# Altium project BMS_Carrier_Board.PrjPcb (part 1 of 2)
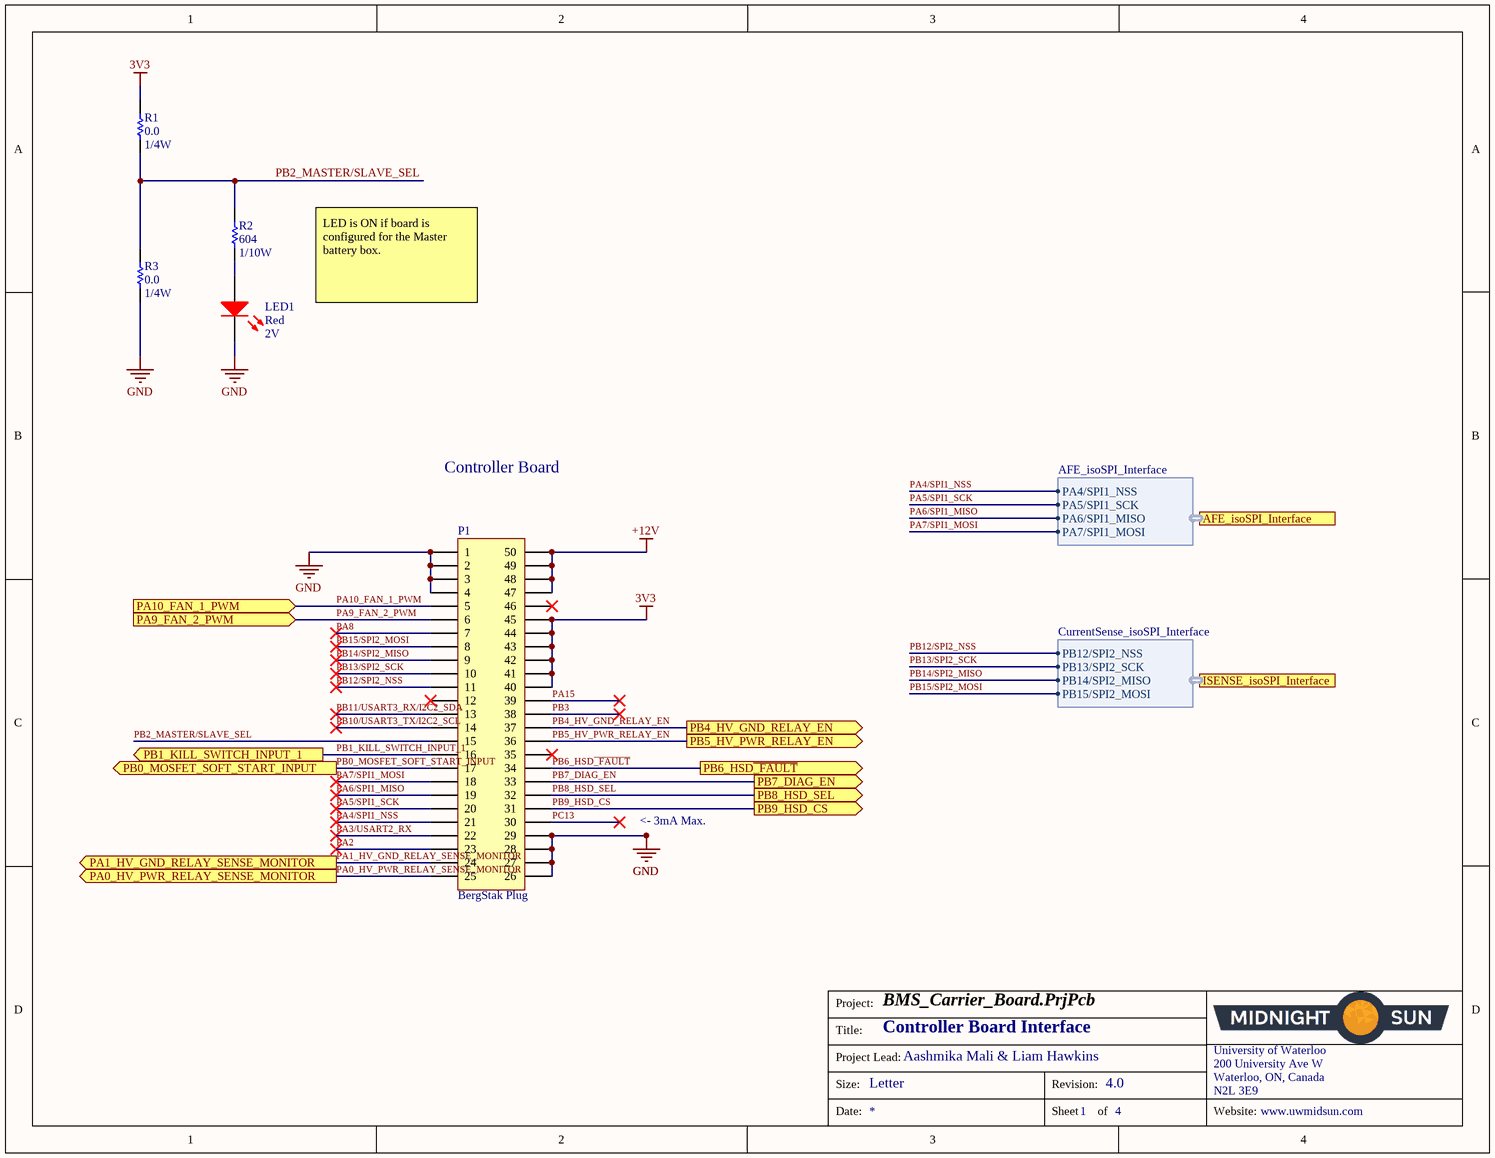
[diagram p0: Controller_Board_Interface.SchDoc]
MSPartNumber: MS-ELE0003; ProjectAuthor: Aashmika Mali & Liam Hawkins; ProjectRevision: 4.0
7 sheets, 99 parts. Net scope: flat (ports and power ports of the same name join across sheets).
Board file: BMS_Carrier_Board.PcbDoc
Sheets:
  Controller_Board_Interface.SchDoc
  BMS Carrier - Connectors.SchDoc
  BMS Carrier - AFE Interface.SchDoc
  BMS Carrier - Current Sense Interface.SchDoc
  BMS Carrier - Battery Relay Controls.SchDoc
  BMS Carrier - Firmware Contactor Control.SchDoc
  BMS Carrier - Fan Controls.SchDoc

## Sheet Controller_Board_Interface.SchDoc: Controller Board Interface
size Letter; Author: Kevin Chen, Taiping Li; DrawnBy: Kevin Chen; DocumentNumber: 1; SheetNumber: 1; SheetTotal: 4; Website: www.uwmidsun.com

### Parts
LED1  Color: Red  Voltage - Forward (Vf) (Typ): 2V  [LED_0603]  (hidden comment: LED RED CLEAR 2V 0603)
P1  Series: BergStak Plug  [CONN, Bergstak 50 Pos Plug]  (hidden comment: CONN 50POS Bergstak Plug 0.02")
R1  Resistance: 0.0  Power (Watts): 1/4W  [RES, 0603]  (hidden comment: RES 0.0 OHM 1/4W 0603)
R2  Resistance: 604  Power: 1/10W  [RES, 0603]  (hidden comment: RES 604 OHM 1% 1/10W 0603)
R3  Resistance: 0.0  Power (Watts): 1/4W  [RES, 0603]  (hidden comment: RES 0.0 OHM 1/4W 0603)

### Ports
AFE_isoSPI_Interface (harness AFE_isoSPI_Interface), ISENSE_isoSPI_Interface (harness CurrentSense_isoSPI_Interface), PA0_HV_PWR_RELAY_SENSE_MONITOR (out), PA1_HV_GND_RELAY_SENSE_MONITOR (out), PA9_FAN_2_PWM (in), PA10_FAN_1_PWM (in), PB0_MOSFET_SOFT_START_INPUT (out), PB1_KILL_SWITCH_INPUT_1 (out), PB4_HV_GND_RELAY_EN (out), PB5_HV_PWR_RELAY_EN (out), PB6_HSD~{_FAULT} (out), PB7_DIAG_EN (out), PB8_HSD_SEL (out), PB9_HSD_CS (out)

### Harnesses
AFE_isoSPI_Interface: PA7/SPI1_MOSI, PA6/SPI1_MISO, PA5/SPI1_SCK, PA4/SPI1_NSS
CurrentSense_isoSPI_Interface: PB15/SPI2_MOSI, PB14/SPI2_MISO, PB13/SPI2_SCK, PB12/SPI2_NSS

### Nets
3V3: P1.40 P1.41 P1.42 P1.43 P1.44 P1.45 R1.1
+12V: P1.47 P1.48 P1.49 P1.50
GND: LED1.2(K) P1.1 P1.2 P1.3 P1.4 P1.26 P1.27 P1.28 P1.29 R3.2
PA0_HV_PWR_RELAY_SENSE_MONITOR: P1.25 ; port PA0_HV_PWR_RELAY_SENSE_MONITOR
PA1_HV_GND_RELAY_SENSE_MONITOR: P1.24 ; port PA1_HV_GND_RELAY_SENSE_MONITOR
PA2: P1.23
PA3/USART2_RX: P1.22
PA4/SPI1_NSS: P1.21 ; port AFE_isoSPI_Interface.PA4/SPI1_NSS
PA5/SPI1_SCK: P1.20 ; port AFE_isoSPI_Interface.PA5/SPI1_SCK
PA6/SPI1_MISO: P1.19 ; port AFE_isoSPI_Interface.PA6/SPI1_MISO
PA7/SPI1_MOSI: P1.18 ; port AFE_isoSPI_Interface.PA7/SPI1_MOSI
PA8: P1.7
PA9_FAN_2_PWM: P1.6 ; port PA9_FAN_2_PWM
PA10_FAN_1_PWM: P1.5 ; port PA10_FAN_1_PWM
PA15: P1.39
PB0_MOSFET_SOFT_START_INPUT: P1.17 ; port PB0_MOSFET_SOFT_START_INPUT
PB1_KILL_SWITCH_INPUT_1: P1.16 ; port PB1_KILL_SWITCH_INPUT_1
PB2_MASTER/SLAVE_SEL: P1.15 R1.2 R2.1 R3.1
PB3: P1.38
PB4_HV_GND_RELAY_EN: P1.37 ; port PB4_HV_GND_RELAY_EN
PB5_HV_PWR_RELAY_EN: P1.36 ; port PB5_HV_PWR_RELAY_EN
PB6_HSD~{_FAULT}: P1.34 ; port PB6_HSD~{_FAULT}
PB7_DIAG_EN: P1.33 ; port PB7_DIAG_EN
PB8_HSD_SEL: P1.32 ; port PB8_HSD_SEL
PB9_HSD_CS: P1.31 ; port PB9_HSD_CS
PB10/USART3_TX/I2C2_SCL: P1.14
PB11/USART3_RX/I2C2_SDA: P1.13
PB12/SPI2_NSS: P1.11 ; port ISENSE_isoSPI_Interface.PB12/SPI2_NSS
PB13/SPI2_SCK: P1.10 ; port ISENSE_isoSPI_Interface.PB13/SPI2_SCK
PB14/SPI2_MISO: P1.9 ; port ISENSE_isoSPI_Interface.PB14/SPI2_MISO
PB15/SPI2_MOSI: P1.8 ; port ISENSE_isoSPI_Interface.PB15/SPI2_MOSI
PC13: P1.30
NetLED1_1: LED1.1(A) R2.2

Not connected (* = marked no-connect by the designer): P1 12* 35* 46*

### Notes on the sheet
- LED is ON if board is configured for the Master battery box.
- Controller Board
- <- 3mA Max.
- Project:
- Title:
- Size:
- Project Lead:
- Letter
- Revision:
- University of Waterloo
- 200 University Ave W
- Waterloo, ON, Canada
- N2L 3E9
- Date:
- Sheet
- of
- Website:

### Library data of the parts
LED1 = LED RED CLEAR 2V 0603: Red 631nm LED Indication - Discrete 2V 0603 (1608 Metric); Manufacturer: Wurth Electronics Inc.; Manufacturer Part Number: 150060RS75000; Lens Color: Colorless; Millicandela Rating: 250mcd; Lens Style/Size: Rectangle with Flat Top, 1.10mm x 0.70mm; Current - Test: 20mA; Viewing Angle: 140°; Wavelength - Dominant: 625nm; Wavelength - Peak: 630nm; Supplier 1: Digi-Key; RoHS: RoHS Compliant; Category: Optoelectronics; Stock 1: 35521; Pricing 1: 1=0.21, 100=0.1617, 500=0.13964 (CAD); Packaging: Cut Tape (CT); Part Status: Active; Lens Transparency: Clear; Mounting Type: Surface Mount; Features: -; Package / Case: 0603 (1608 Metric); Supplier Device Package: 0603; Size / Dimension: 1.60mm L x 0.80mm W; Height (Max): 0.80mm; ComponentLink1URL: http://katalog.we-online.de/led/datasheet/150060RS75000.pdf; ComponentLink1Description: http://katalog.we-online.de/led/datasheet/150060RS75000.pdf; Supplier Part Number 1: 732-4978-1-ND
P1 = CONN 50POS Bergstak Plug 0.02": 50 Position Connector Plug, Outer Shroud Contacts Surface Mount Gold; Manufacturer 1: Amphenol FCI; Manufacturer Part Number 1: 10132797-055100LF; Number of Positions: 50; Mated Stacking Heights: 5mm; Pitch: 0.020" (0.50mm); Supplier 1: Digi-Key; Supplier Part Number 1: 609-5226-1-ND; Packaging: Cut Tape (CT); Part Status: Active; Connector Type: Plug, Outer Shroud Contacts; Number of Rows: 2; Mounting Type: Surface Mount; Contact Finish: Gold; Contact Finish Thickness: 1µin (0.025µm); Height Above Board: 0.169" (4.30mm); ComponentLink1URL: http://portal.fciconnect.com/Comergent//fci/drawing/10132797.pdf; ComponentLink1Description: http://portal.fciconnect.com/Comergent//fci/drawing/10132797.pdf
R1 R3 = RES 0.0 OHM 1/4W 0603: RES SMD 0.0 OHM JUMPER 1/4W 0603; Manufacturer 1: Vishay Dale; Manufacturer Part Number 1: CRCW06030000Z0EAHP; Supplier 1: Digi-Key; Supplier Part Number 1: 541-0.0SBCT-ND; Packaging: Cut Tape (CT); Part Status: Active; Composition: Thick Film; Operating Temperature: -55°C ~ 155°C; Package / Case: 0603 (1608 Metric); Supplier Device Package: 0603; Size / Dimension: 0.063" L x 0.033" W (1.60mm x 0.85mm); Height - Seated (Max): 0.022" (0.55mm); Failure Rate: -; ComponentLink1URL: http://www.vishay.com/docs/20043/crcwhpe3.pdf; ComponentLink1Description: http://www.vishay.com/docs/20043/crcwhpe3.pdf
R2 = RES 604 OHM 1% 1/10W 0603: RES SMD 604 OHM 1% 1/10W 0603; Manufacturer 1: Yageo; Manufacturer Part Number 1: RC0603FR-07604RL; Temperature Coefficient: ±100ppm/°C; Supplier 1: Digi-Key; Supplier Part Number 1: 311-604HRCT-ND; Packaging: Cut Tape (CT); Part Status: Active; Composition: Thick Film; Operating Temperature: -55°C ~ 155°C; Package / Case: 0603 (1608 Metric); Supplier Device Package: 0603; Size / Dimension: 0.063" L x 0.031" W (1.60mm x 0.80mm); Height - Seated (Max): 0.022" (0.55mm); Failure Rate: -; ComponentLink1URL: http://www.yageo.com/documents/recent/PYu-RC_Group_51_RoHS_L_7.pdf; ComponentLink1Description: http://www.yageo.com/documents/recent/PYu-RC_Group_51_RoHS_L_7.pdf; Tolerance: ±1%

## Sheet BMS Carrier - Connectors.SchDoc: BMS Fan and Relay Control
size B; Author: Kevin Chen, Taiping Li; DocumentNumber: 4; SheetNumber: 4; SheetTotal: 4; Website: www.uwmidsun.com
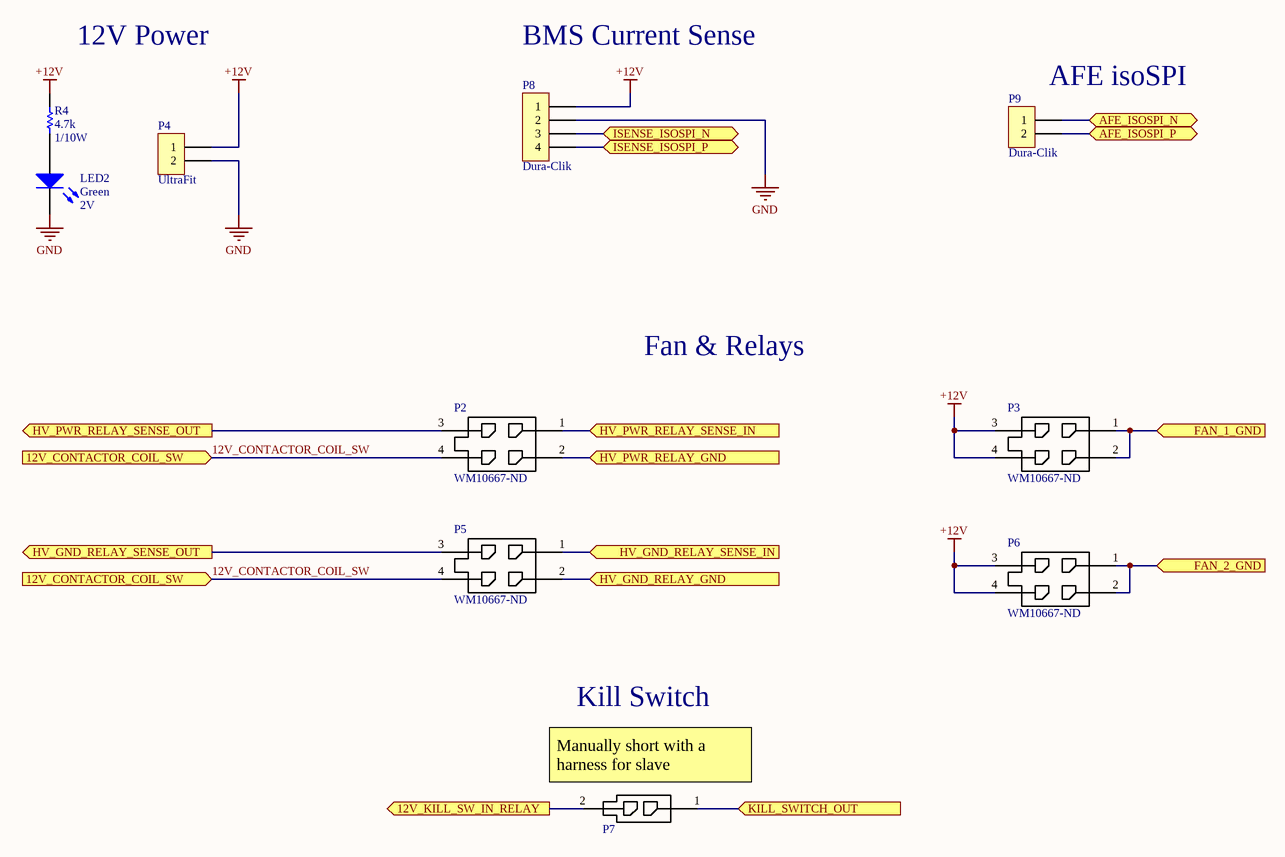
[diagram p1: BMS Carrier - Connectors.SchDoc]

### Parts
LED2  Color: Green  Voltage - Forward (Vf) (Typ): 2V  [LED_0603]  (hidden comment: LED GREEN CLEAR 2V 0603)
P2  Supplier Part Number 1: WM10667-ND  [CONN 4POS MICROFIT (2x2)]  (hidden comment: CONN 4POS MICRO-FIT 3mm)
P3  Supplier Part Number 1: WM10667-ND  [CONN 4POS MICROFIT (2x2)]  (hidden comment: CONN 4POS MICRO-FIT 3mm)
P4  Series: UltraFit  [CONN, 2POS ULTRA-FIT]  (hidden comment: CONN 2POS ULTRA-FIT 0.138")
P5  Supplier Part Number 1: WM10667-ND  [CONN 4POS MICROFIT (2x2)]  (hidden comment: CONN 4POS MICRO-FIT 3mm)
P6  Supplier Part Number 1: WM10667-ND  [CONN 4POS MICROFIT (2x2)]  (hidden comment: CONN 4POS MICRO-FIT 3mm)
P7  CONN 2POS MICRO-FIT 3mm  [CONN, 2POS MICRO-FIT]  (value not drawn)
P8  Dura-Clik  [CONN, 4POS DURA-CLIK VERT]
P9  Dura-Clik  [CONN, 2POS Dura-Click Vertical]
R4  Resistance (Ohms): 4.7k  Power (Watts): 1/10W  [RES, 0603]  (hidden comment: RES 4.7K OHM 1% 1/10W 0603)

### Ports
12V_CONTACTOR_COIL_SW (in), 12V_KILL_SW_IN_RELAY (out), AFE_ISOSPI_N (bidir), AFE_ISOSPI_P (bidir), FAN_1_GND (in), FAN_2_GND (in), HV_GND_RELAY_GND (in), HV_GND_RELAY_SENSE_IN (in), HV_GND_RELAY_SENSE_OUT (out), HV_PWR_RELAY_GND (in), HV_PWR_RELAY_SENSE_IN (in), HV_PWR_RELAY_SENSE_OUT (out), ISENSE_ISOSPI_N (bidir), ISENSE_ISOSPI_P (bidir), KILL_SWITCH_OUT (in)

### Nets
3V3: P2.3 P5.3 ; port HV_PWR_RELAY_SENSE_OUT, port HV_GND_RELAY_SENSE_OUT
+12V: P3.3 P3.4 P4.1 P6.3 P6.4 P8.1 R4.1
GND: LED2.2(K) P4.2 P8.2
12V_CONTACTOR_COIL_SW: P2.4 P5.4 ; port 12V_CONTACTOR_COIL_SW
12V_KILL_SW_to_Relay: P7.2 ; port 12V_KILL_SW_IN_RELAY
CURR_ISOSPI_N: P8.3 ; port ISENSE_ISOSPI_N
CURR_ISOSPI_P: P8.4 ; port ISENSE_ISOSPI_P
ISOSPI_N: P9.1 ; port AFE_ISOSPI_N
ISOSPI_P: P9.2 ; port AFE_ISOSPI_P
NetC14_1: P2.1 ; port HV_PWR_RELAY_SENSE_IN
NetC18_1: P5.1 ; port HV_GND_RELAY_SENSE_IN
NetD1_1: P2.2 ; port HV_PWR_RELAY_GND
NetD3_1: P5.2 ; port HV_GND_RELAY_GND
NetLED2_1: LED2.1(A) R4.2
NetLED5_2: P3.1 P3.2 ; port FAN_1_GND
NetLED6_2: P6.1 P6.2 ; port FAN_2_GND
NetP7_1: P7.1 ; port KILL_SWITCH_OUT

### Notes on the sheet
- 12V Power
- BMS Current Sense
- (near P9) AFE isoSPI
- Fan & Relays
- Kill Switch
- (near P7) Manually short with a harness for slave
- PROJECT
- DOCUMENT
- DRAWN BY
- LAST MODIFIED
- PART NUMBER
- REVISION
- SHEET
- VARIANT
- OF
- Engineering 5 - 1002
  University of Waterloo
  (519) 888-4567 x32978
  hardware@uwmidsun.com

### Library data of the parts
LED2 = LED GREEN CLEAR 2V 0603: Green 572nm LED Indication - Discrete 2V 0603 (1608 Metric); Manufacturer: Wurth Electronics Inc.; Manufacturer Part Number: 150060VS75000; Lens Color: Colorless; Millicandela Rating: 40mcd; Lens Style/Size: Rectangle with Flat Top, 1.10mm x 0.70mm; Current - Test: 20mA; Viewing Angle: 140°; Wavelength - Dominant: 570nm; Supplier 1: Digi-Key; RoHS: RoHS Compliant; Category: Optoelectronics; Stock 1: 9408; Pricing 1: 1=0.21, 100=0.1617, 500=0.13964 (CAD); Packaging: Cut Tape (CT); Part Status: Active; Lens Transparency: Clear; Mounting Type: Surface Mount; Wavelength - Peak: 572nm; Features: -; Package / Case: 0603 (1608 Metric); Supplier Device Package: 0603; Size / Dimension: 1.60mm L x 0.80mm W; Height (Max): 0.80mm; ComponentLink1URL: http://katalog.we-online.de/led/datasheet/150060VS75000.pdf; ComponentLink1Description: http://katalog.we-online.de/led/datasheet/150060VS75000.pdf; Supplier Part Number 1: 732-4980-1-ND
P2 P3 P5 P6 = CONN 4POS MICRO-FIT 3mm: Micro-Fit 3.0 Vertical Header, 3.00mm Pitch, Dual Row, 4 Circuits, with PCB Polarizing Peg, Tin, Glow-Wire Capable, Black; Manufacturer: Molex, LLC; Manufacturer Part Number: 0430450827; Pitch - Mating: 0.118" (3.00mm); Number of Positions: 6; Number of Positions Loaded: All; Style: Board to Cable/Wire; Shrouding: Shrouded - 4 Wall; Contact Length - Post: 0.125" (3.18mm); Material Flammability Rating: UL94 V-0; Contact Resistance: 10mR; Number of Contacts: 4; Number of Ports: 1; Row Spacing: 0.118inch; RoHS: RoHS Compliant; Category: Connectors, Interconnects; Packaging: Tray; Part Status: Active; Connector Type: Header; Contact Type: Male Pin; Number of Rows: 2; Row Spacing - Mating: 0.118" (3.00mm); Mounting Type: Through Hole; Termination: Solder; Fastening Type: Locking Ramp; Contact Length - Mating: -; Overall Contact Length: -; Insulation Height: 0.390" (9.91mm); Contact Shape: Square; Contact Finish - Mating: Tin; Contact Finish Thickness - Mating: 60.0µin (1.52µm); Contact Finish - Post: Tin; Contact Material: Brass; Insulation Material: Liquid Crystal Polymer (LCP), Glass Filled; Features: Board Guide; Operating Temperature: -; Ingress Protection: -; Insulation Color: Black; Current Rating: -; Voltage Rating: -; Mated Stacking Heights: -; Contact Finish Thickness - Post: -; Applications: General Purpose, Medical, Military, Telecommunications; ComponentLink1URL: https://www.molex.com/pdm_docs/sd/430450627_sd.pdf; ComponentLink1Description: https://www.molex.com/pdm_docs/sd/430450627_sd.pdf; ComponentLink2URL: https://www.molex.com/pdm_docs/sd/430450827_sd.pdf; ComponentLink2Description: https://www.molex.com/pdm_docs/sd/430450827_sd.pdf; Mount: Through Hole; Contact Plating: Tin; Housing Material: Polymer; Color: Black; Number of Terminals: 4; Housing Color: Black; Min Operating Temperature: -40°C; Max Operating Temperature: 105°C; Package Quantity: 2232; Orientation: Straight; Length: 10.15mm; Pitch: 3mm; Depth: 8.77mm; ComponentLink3URL: http://www.molex.com/pdm_docs/sd/430450427_sd.pdf; ComponentLink3Description: http://www.molex.com/pdm_docs/sd/430450427_sd.pdf; ComponentLink4URL: http://www.molex.com/webdocs/datasheets/pdf/en-us/0430450427_PCB_HEADERS.pdf; ComponentLink4Description: http://www.molex.com/webdocs/datasheets/pdf/en-us/0430450427_PCB_HEADERS.pdf; Supplier 1: Digi-Key
P4 = CONN 2POS ULTRA-FIT 0.138": 2 Positions Header, Shrouded Connector 0.138" (3.50mm) Through Hole Gold; Manufacturer 1: Molex, LLC; Manufacturer Part Number 1: 1722861302; Style: Board to Board or Cable; Shrouding: Shrouded - 4 Wall; Number of Positions: 2; Number of Positions Loaded: All; Contact Length - Post: 0.126" (3.20mm); Material Flammability Rating: UL94 V-0; Mated Stacking Heights: 26.99mm; Voltage: 400V; Supplier 1: Digi-Key; Supplier Part Number 1: WM11673-ND; Packaging: Tray; Part Status: Active; Connector Type: Header; Contact Type: Male Pin; Pitch - Mating: 0.138" (3.50mm); Number of Rows: 1; Row Spacing - Mating: -; Mounting Type: Through Hole; Termination: Kinked Pin, Solder; Fastening Type: Latch Holder; Contact Length - Mating: -; Overall Contact Length: -; Insulation Height: 0.465" (11.80mm); Contact Shape: Square; Contact Finish - Mating: Gold; Contact Finish Thickness - Mating: 30µin (0.76µm); Contact Finish - Post: Tin; Contact Material: Copper Alloy; Insulation Material: Liquid Crystal Polymer (LCP); Operating Temperature: -40°C ~ 120°C; Ingress Protection: -; Insulation Color: Black; Current Rating: -; Contact Finish Thickness - Post: 60µin (1.52µm); ComponentLink1URL: http://www.molex.com/pdm_docs/sd/1722861302_sd.pdf; ComponentLink1Description: http://www.molex.com/pdm_docs/sd/1722861302_sd.pdf
P7 = CONN 2POS MICRO-FIT 3mm: Connector Header Through Hole 2 position; Manufacturer: Molex; Manufacturer Part Number: 43045-0227; Number of Positions: 2; Current Rating: 5A; Gender: Male; Contact Resistance: 10mR; Number of Ports: 1; Max Voltage Rating (DC): 250.25kV; Voltage Rating: 600V; Glow Wire Compliant: Compliant; Supplier 1: Digi-Key; Supplier Part Number 1: WM10657-ND; Packaging: Tray; Number of Rows: 2; Termination: Solder; Contact Material: Brass; ComponentLink1URL: http://www.onlinecomponents.com/productFiles/mf-MOL/307170430450227_pcb_headers.pdf; ComponentLink1Description: http://www.onlinecomponents.com/productFiles/mf-MOL/307170430450227_pcb_headers.pdf; Stock 1: 3657; Pricing 1: 1=0.84, 10=0.74, 25=0.6968, 50=0.6676, 100=0.6387, 250=0.5806, 500=0.52254, 1000=0.46448, 2500=0.42094 (USD); Mount: Through Hole; Contact Plating: Tin; Housing Colour: Black; Housing Material: Thermoplastic; Number of Terminals: 2; Min Operating Temperature: -40°C; Max Operating Temperature: 105°C; Number of Contacts: 2; Orientation: Vertical; Package Quantity: 3168; Number of Circuits: 2; Length: 7.15mm; Pitch: 3mm; Depth: 8.77mm; Row Spacing: 3mm; Radiation Hardening: No; Halogen Free: Low Halogen; ComponentLink2URL: http://www.mouser.com/ds/2/276/0430450227_PCB_HEADERS-142611.pdf; ComponentLink2Description: http://www.mouser.com/ds/2/276/0430450227_PCB_HEADERS-142611.pdf; ComponentLink3URL: http://uk.rs-online.com/webdocs/13c3/0900766b813c3a46.pdf; ComponentLink3Description: http://uk.rs-online.com/webdocs/13c3/0900766b813c3a46.pdf; ComponentLink4URL: http://www.molex.com/webdocs/datasheets/pdf/en-us/0430450227_PCB_HEADERS.pdf; ComponentLink4Description: http://www.molex.com/webdocs/datasheets/pdf/en-us/0430450227_PCB_HEADERS.pdf
P8 = CONN 4POS DURA-CLIK 0.079": 4 Positions Header Connector 0.079" (2.00mm) Surface Mount Tin; Manufacturer: Molex, LLC; Manufacturer Part Number: 5600200420; Style: Board to Cable/Wire; Shrouding: Shrouded - 4 Wall; Number of Positions: 4; Number of Positions Loaded: All; Mated Stacking Heights: 9.3mm; Supplier 1: Digi-Key; RoHS: RoHS Compliant; Category: Connectors, Interconnects; Stock 1: 9367; Pricing 1: 1=2.23, 10=2.022, 25=1.898, 50=1.8156, 100=1.733 (CAD); Packaging: Cut Tape (CT); Part Status: Active; Connector Type: Header; Contact Type: Male Pin; Pitch - Mating: 0.079" (2.00mm); Number of Rows: 1; Row Spacing - Mating: -; Mounting Type: Surface Mount; Termination: Solder; Fastening Type: Latch Lock; Contact Length - Mating: -; Contact Length - Post: -; Overall Contact Length: -; Insulation Height: 0.315" (8.00mm); Contact Shape: Square; Contact Finish - Mating: Tin; Contact Finish Thickness - Mating: -; Contact Finish - Post: Tin; Contact Material: Copper Alloy; Insulation Material: Polyamide (PA), Nylon; Features: Solder Retention; Operating Temperature: -; Ingress Protection: -; Material Flammability Rating: -; Insulation Color: Natural; Current Rating: -; Voltage Rating: -; Contact Finish Thickness - Post: -; Applications: Automotive, Industrial; ComponentLink1URL: http://www.molex.com/pdm_docs/sd/5600200420_sd.pdf; ComponentLink1Description: http://www.molex.com/pdm_docs/sd/5600200420_sd.pdf; Supplier Part Number 1: WM10864CT-ND
P9 = CONN 2POS DURA-CLIK 0.079" VERT: 2 Positions Header, Shrouded Connector 0.079" (2.00mm) Surface Mount, Vertical Tin; Manufacturer: Molex, LLC; Manufacturer Part Number: 5600200220; Style: Board to Cable/Wire; Shrouding: Shrouded - 4 Wall; Number of Positions: 2; Number of Positions Loaded: All; Mated Stacking Heights: 9.3mm; Supplier 1: Digi-Key; RoHS: RoHS Compliant; Category: Connectors, Interconnects; Stock 1: 11912; Pricing 1: 1=1.16, 10=1.012, 25=0.952, 50=0.9122, 100=0.8727, 250=0.79336 (CAD); Packaging: Cut Tape (CT); Part Status: Active; Connector Type: Header; Contact Type: Male Pin; Pitch - Mating: 0.079" (2.00mm); Number of Rows: 1; Row Spacing - Mating: -; Mounting Type: Surface Mount; Termination: Solder; Fastening Type: Latch Lock; Contact Length - Mating: -; Contact Length - Post: -; Overall Contact Length: -; Insulation Height: 0.315" (8.00mm); Contact Shape: Square; Contact Finish - Mating: Tin; Contact Finish Thickness - Mating: -; Contact Finish - Post: Tin; Contact Material: Copper Alloy; Insulation Material: Polyamide (PA), Nylon; Features: Solder Retention; Operating Temperature: -; Ingress Protection: -; Material Flammability Rating: -; Insulation Color: Natural; Current Rating: -; Voltage Rating: -; Contact Finish Thickness - Post: -; Applications: Automotive, Industrial; ComponentLink1URL: http://www.molex.com/pdm_docs/sd/5600200220_sd.pdf; ComponentLink1Description: http://www.molex.com/pdm_docs/sd/5600200220_sd.pdf; Supplier Part Number 1: WM10862CT-ND
R4 = RES 4.7K OHM 1% 1/10W 0603: 4.7k Ohm ±1% 0.1W, 1/10W Chip Resistor 0603 (1608 Metric) Moisture Resistant Thick Film; Manufacturer 1: Yageo; Manufacturer Part Number 1: RC0603FR-074K7L; Description 1: RES SMD 4.7K OHM 1% 1/10W 0603; Temperature Coefficient: ±100ppm/°C; Supplier 1: Digi-Key; Supplier Part Number 1: 311-4.70KHRCT-ND; RoHS: RoHS Compliant; Category: Resistors; Stock 1: 3487566; Pricing 1: 1=0.16, 10=0.022, 100=0.0089, 1000=0.00402, 2500=0.00349 (CAD); Packaging: Cut Tape (CT); Part Status: Active; Composition: Thick Film; Features: Moisture Resistant; Operating Temperature: -55°C ~ 155°C; Package / Case: 0603 (1608 Metric); Supplier Device Package: 0603; Size / Dimension: 0.063" L x 0.031" W (1.60mm x 0.80mm); Height - Seated (Max): 0.022" (0.55mm); Failure Rate: -; ComponentLink1URL: http://www.yageo.com/documents/recent/PYu-RC_Group_51_RoHS_L_7.pdf; ComponentLink1Description: http://www.yageo.com/documents/recent/PYu-RC_Group_51_RoHS_L_7.pdf; Tolerance: ±1%

## Sheet BMS Carrier - AFE Interface.SchDoc: BMS Interface
size Letter; Author: Kevin Chen; DocumentNumber: 3; SheetNumber: 3; SheetTotal: 4; Website: www.uwmidsun.com
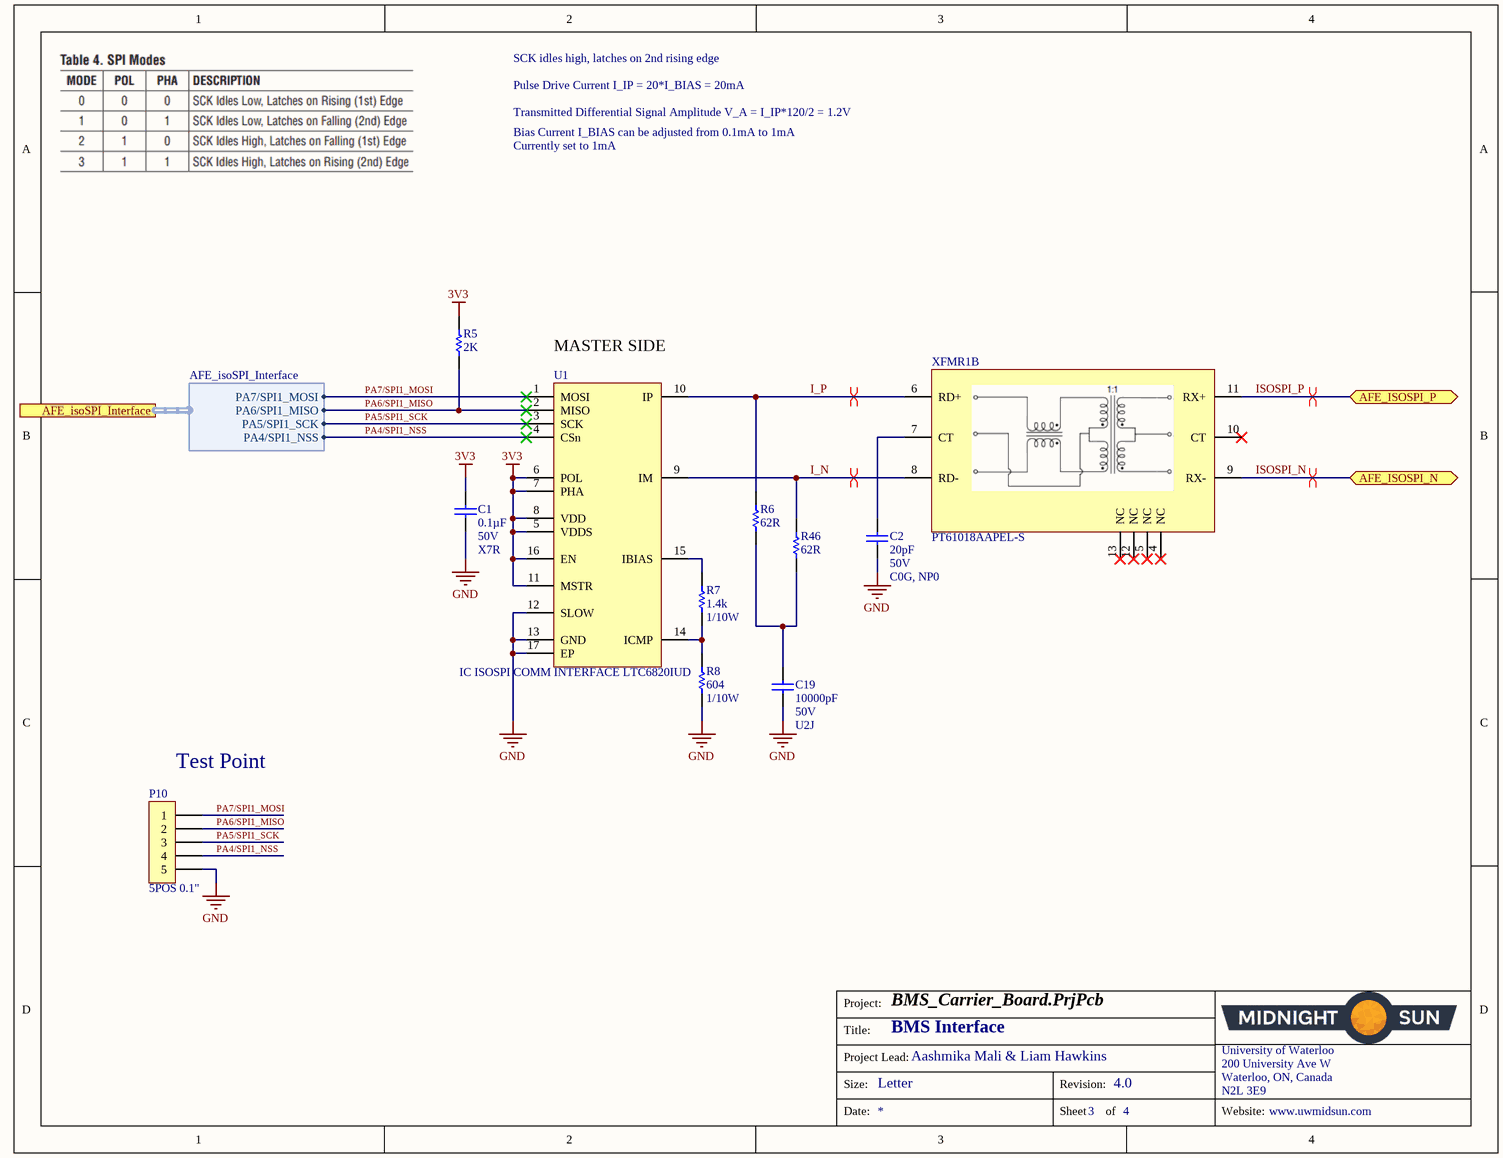
[diagram p2: BMS Carrier - AFE Interface.SchDoc]

### Parts
C1  Capacitance: 0.1µF  Voltage: 50V  Temperature Coefficient: X7R  [CAP, 0603]  (hidden comment: CAP CER 0.1UF 50V 10% X7R 0603)
C2  Capacitance: 20pF  Voltage: 50V  Temperature Coefficient: C0G, NP0  [CAP, 0603]  (hidden comment: CAP CER 20PF 50V ±5% C0G/NP0 0603)
C19  Capacitance: 10000pF  Voltage: 50V  Temperature Coefficient: U2J  [CAP, 0603]  (hidden comment: CAP CER 10nF 50V 5% X7R 0603)
P10  5POS 0.1"  [CONN, 5POS HEADR 0.1"]
R5  2K  [RES, 0603]
R6  62R  [RES, 0603]
R7  Resistance: 1.4k  Power: 1/10W  [RES, 0603]  (hidden comment: RES 1.4k OHM 1% 1/10W 0603)
R8  Resistance: 604  Power: 1/10W  [RES, 0603]  (hidden comment: RES 604 OHM 1% 1/10W 0603)
R46  62R  [RES, 0603]
U1  IC ISOSPI COMM INTERFACE LTC6820IUD  [IC COMM INTERFACE ISOSPI 16-QFN]
XFMR1  MFG_PN: PT61018AAPEL-S  [IC, PULSE XFMR 1CT:1CT 350UH SMD]  (hidden comment: IC PULSE XFMR 1CT:1CT 350UH SMD)  (part B of 2)

### Ports
AFE_isoSPI_Interface (harness AFE_isoSPI_Interface), AFE_ISOSPI_N (bidir), AFE_ISOSPI_P (bidir)

### Harnesses
AFE_isoSPI_Interface: PA7/SPI1_MOSI, PA6/SPI1_MISO, PA5/SPI1_SCK, PA4/SPI1_NSS

### Nets
3V3: C1.1 R5.1 U1.5(VDDS) U1.6(POL) U1.7(PHA) U1.8(VDD) U1.11(MSTR) U1.16(EN)
GND: C1.2 C2.2 C19.2 P10.5 R8.2 U1.12(SLOW) U1.13(GND) U1.17(EP)
I_N: R46.1 U1.9(IM) XFMR1.8(RD-)
I_P: R6.1 U1.10(IP) XFMR1.6(RD+)
ISOSPI_N: XFMR1.9(RX-) ; port AFE_ISOSPI_N
ISOSPI_P: XFMR1.11(RX+) ; port AFE_ISOSPI_P
PA4/SPI1_NSS: P10.4 U1.4(CSn) ; port AFE_isoSPI_Interface.PA4/SPI1_NSS
PA5/SPI1_SCK: P10.3 U1.3(SCK) ; port AFE_isoSPI_Interface.PA5/SPI1_SCK
PA6/SPI1_MISO: P10.2 R5.2 U1.2(MISO) ; port AFE_isoSPI_Interface.PA6/SPI1_MISO
PA7/SPI1_MOSI: P10.1 U1.1(MOSI) ; port AFE_isoSPI_Interface.PA7/SPI1_MOSI
NetC2_1: C2.1 XFMR1.7(CT)
NetC19_1: C19.1 R6.2 R46.2
NetR7_1: R7.1 U1.15(IBIAS)
NetR7_2: R7.2 R8.1 U1.14(ICMP)

Not connected (* = marked no-connect by the designer): XFMR1 4(NC)* 5(NC)* 10(CT)* 12(NC)* 13(NC)*

### Layout directives
differential pair: I_N, I_P, ISOSPI_N, ISOSPI_P

### Notes on the sheet
- Pulse Drive Current I_IP = 20*I_BIAS = 20mA
- SCK idles high, latches on 2nd rising edge
- Bias Current I_BIAS can be adjusted from 0.1mA to 1mA
- Currently set to 1mA
- Transmitted Differential Signal Amplitude V_A = I_IP*120/2 = 1.2V
- (near U1) MASTER SIDE
- (near P10) Test Point
- Project:
- Title:
- Size:
- Project Lead:
- Letter
- Revision:
- University of Waterloo
- 200 University Ave W
- Waterloo, ON, Canada
- N2L 3E9
- Date:
- Sheet
- of
- Website:

### Library data of the parts
C1 = CAP CER 0.1UF 50V 10% X7R 0603: 0.10µF ±10% 50V Ceramic Capacitor X7R 0603 (1608 Metric); Manufacturer 1: AVX Corporation; Manufacturer Part Number 1: 06035C104KAT2A; Supplier 1: Digi-Key; Supplier Part Number 1: 478-5052-1-ND; Packaging: Cut Tape (CT); Part Status: Active; Operating Temperature: -55°C ~ 125°C; Ratings: -; Mounting Type: Surface Mount, MLCC; Package / Case: 0603 (1608 Metric); Size / Dimension: 0.063" L x 0.032" W (1.60mm x 0.81mm); Height - Seated (Max): -; Thickness (Max): 0.035" (0.90mm); Lead Spacing: -; Lead Style: -; ComponentLink1URL: http://datasheets.avx.com/X7RDielectric.pdf; ComponentLink1Description: http://datasheets.avx.com/X7RDielectric.pdf; Tolerance: ±10%
C2 = CAP CER 20PF 50V ±5% C0G/NP0 0603: 20pF ±5% 50V Ceramic Capacitor C0G, NP0 0603 (1608 Metric); Manufacturer 1: Murata Electronics North America; Manufacturer Part Number 1: GRM1885C1H200JA01D; Supplier 1: Digi-Key; Supplier Part Number 1: 490-1410-1-ND; Packaging: Cut Tape (CT); Part Status: Active; Operating Temperature: -55°C ~ 125°C; Ratings: -; Mounting Type: Surface Mount, MLCC; Package / Case: 0603 (1608 Metric); Size / Dimension: 0.063" L x 0.031" W (1.60mm x 0.80mm); Height - Seated (Max): -; Thickness (Max): 0.035" (0.90mm); Lead Spacing: -; Lead Style: -; ComponentLink1URL: http://www.murata.com/~/media/webrenewal/support/library/catalog/products/capacitor/mlcc/c02e.ashx; ComponentLink1Description: http://www.murata.com/~/media/webrenewal/support/library/catalog/products/capacitor/mlcc/c02e.ashx; Tolerance: ±5%
C19 = CAP CER 10nF 50V 5% X7R 0603: 10000pF ±5% 50V Ceramic Capacitor U2J 0603 (1608 Metric); Manufacturer 1: KEMET; Manufacturer Part Number 1: C0603C103J5JAC7867; Supplier 1: Digi-Key; Supplier Part Number 1: 399-13384-1-ND; Packaging: Cut Tape (CT); Part Status: Active; Operating Temperature: -55°C ~ 125°C; Ratings: -; Failure Rate: -; Mounting Type: Surface Mount, MLCC; Package / Case: 0603 (1608 Metric); Size / Dimension: 0.063" L x 0.032" W (1.60mm x 0.80mm); Height - Seated (Max): -; Thickness (Max): 0.034" (0.87mm); Lead Spacing: -; Lead Style: -; ComponentLink1URL: http://www.kemet.com/docfinder?Partnumber=C0603C103J5JAC7867; ComponentLink1Description: http://www.kemet.com/docfinder?Partnumber=C0603C103J5JAC7867; Tolerance: ±5%
P10 = CONN 5POS HEADR MALE 0.1": Manufacturer 1: Molex; Manufacturer Part Number 1: 0022284050; Description 1: Conn Unshrouded Header HDR 5 POS 2.54mm Solder ST Thru-Hole KK® Bag; Contact Resistance: 20mR; Number of Positions: 5; Gender: Male; Connector Type: Male Pin; Max Voltage Rating (AC): 250V; Pitch: 2.54mm; Supplier 1: Digi-Key; Supplier Part Number 1: WM50014-05-ND; Stock 1: 3161; Pricing 1: 1=0.22, 10=0.21, 25=0.1796, 50=0.157, 100=0.1459, 250=0.129, 500=0.1234 (USD); Mount: Through Hole; Colour: Black; Contact Plating: Nickel,Tin; Contact Material: Bronze,Brass; Housing Colour: Black; Housing Material: Nylon; Min Operating Temperature: 0°C; Max Operating Temperature: 75°C; Packaging: Bulk; Number of Rows: 1; Termination: Solder; Number of Contacts: 5; Orientation: Straight; Max Voltage Rating (DC): 250V; Length: 12.7mm; Depth: 2.49mm; Contact Mating Length: 0.24inch; ComponentLink1URL: https://datasheet.ciiva.com/6814/022284363-sd-6814049.pdf; ComponentLink1Description: https://datasheet.ciiva.com/6814/022284363-sd-6814049.pdf; ComponentLink2URL: https://datasheet.ciiva.com/14804/179390022284050-pcb-headers-14804361.pdf; ComponentLink2Description: https://datasheet.ciiva.com/14804/179390022284050-pcb-headers-14804361.pdf; ComponentLink3URL: https://datasheet.ciiva.com/15217/getdatasheetpartid-256138-15217709.pdf; ComponentLink3Description: https://datasheet.ciiva.com/15217/getdatasheetpartid-256138-15217709.pdf
R5 = RES 2K OHM 1% 1/10W 0603: 2k Ohm ±1% 0.1W, 1/10W Chip Resistor 0603 (1608 Metric) Moisture Resistant Thick Film; Manufacturer: Yageo; Manufacturer Part Number: RC0603FR-072KL; Temperature Coefficient: ±100ppm/°C; Supplier 1: Digi-Key; RoHS: RoHS Compliant; Category: Resistors; Stock 1: 1750701; Pricing 1: 1=0.15, 10=0.023, 100=0.0093, 1000=0.00415, 2500=0.0036 (CAD); Packaging: Cut Tape (CT); Part Status: Active; Resistance (Ohms): 2k; Tolerance: ±1%; Power (Watts): 0.1W, 1/10W; Composition: Thick Film; Features: Moisture Resistant; Operating Temperature: -55°C ~ 155°C; Package / Case: 0603 (1608 Metric); Supplier Device Package: 0603; Size / Dimension: 0.063" L x 0.031" W (1.60mm x 0.80mm); Height - Seated (Max): 0.022" (0.55mm); Failure Rate: -; ComponentLink1URL: http://www.yageo.com/documents/recent/PYu-RC_Group_51_RoHS_L_7.pdf; ComponentLink1Description: http://www.yageo.com/documents/recent/PYu-RC_Group_51_RoHS_L_7.pdf; Supplier Part Number 1: 311-2.00KHRCT-ND
R6 R46 = RES 62 OHM 0.1% 1/10W 0603: 62 Ohms ±0.1% 0.1W, 1/10W Chip Resistor 0603 (1608 Metric) Automotive AEC-Q200 Thin Film; Manufacturer: Panasonic Electronic Components; Manufacturer Part Number: ERA-3AEB620V; Temperature Coefficient: ±25ppm/°C; Supplier 1: Digi-Key; RoHS: RoHS Compliant; Category: Resistors; Stock 1: 10320; Pricing 1: 1=0.52, 10=0.447, 100=0.1748, 1000=0.07317, 2500=0.06708 (CAD); Packaging: Cut Tape (CT); Part Status: Active; Tolerance: ±0.1%; Power (Watts): 0.1W, 1/10W; Composition: Thin Film; Features: Automotive AEC-Q200; Operating Temperature: -55°C ~ 155°C; Package / Case: 0603 (1608 Metric); Supplier Device Package: 0603; Size / Dimension: 0.063" L x 0.032" W (1.60mm x 0.80mm); Height - Seated (Max): 0.022" (0.55mm); Failure Rate: -; ComponentLink1URL: https://industrial.panasonic.com/cdbs/www-data/pdf/RDM0000/AOA0000C307.pdf; ComponentLink1Description: https://industrial.panasonic.com/cdbs/www-data/pdf/RDM0000/AOA0000C307.pdf; Supplier Part Number 1: P62DBCT-ND
R7 = RES 1.4k OHM 1% 1/10W 0603: RES SMD 1.4K OHM 1% 1/10W 0603; Manufacturer 1: Yageo; Manufacturer Part Number 1: RC0603FR-071K4L; Temperature Coefficient: ±100ppm/°C; Supplier 1: Digi-Key; Supplier Part Number 1: 311-1.40KHRCT-ND; Packaging: Cut Tape (CT); Part Status: Active; Composition: Thick Film; Operating Temperature: -55°C ~ 155°C; Package / Case: 0603 (1608 Metric); Supplier Device Package: 0603; Size / Dimension: 0.063" L x 0.031" W (1.60mm x 0.80mm); Height - Seated (Max): 0.022" (0.55mm); Failure Rate: -; ComponentLink1URL: http://www.yageo.com/documents/recent/PYu-RC_Group_51_RoHS_L_7.pdf; ComponentLink1Description: http://www.yageo.com/documents/recent/PYu-RC_Group_51_RoHS_L_7.pdf; Tolerance: ±1%
R8 = RES 604 OHM 1% 1/10W 0603: as R2 on sheet Controller_Board_Interface; Supplier 1: Digi-Key; Supplier Part Number 1: 311-604HRCT-ND; Packaging: Cut Tape (CT); Part Status: Active; Composition: Thick Film; Operating Temperature: -55°C ~ 155°C; Package / Case: 0603 (1608 Metric); Supplier Device Package: 0603; Size / Dimension: 0.063" L x 0.031" W (1.60mm x 0.80mm); Height - Seated (Max): 0.022" (0.55mm); Failure Rate: -; ComponentLink1URL: http://www.yageo.com/documents/recent/PYu-RC_Group_51_RoHS_L_7.pdf; ComponentLink1Description: http://www.yageo.com/documents/recent/PYu-RC_Group_51_RoHS_L_7.pdf; Tolerance: ±1%
U1 = IC ISOSPI COMM INTERFACE LTC6820IUD: IC COMM INTERFACE ISOSPI 16-QFN; Manufacturer: Linear Technology; Manufacturer Part Number: LTC6820IUD#PBF; Interface: SPI; Voltage - Supply: 2.7 V ~ 5.5 V; Supplier 1: Digi-Key; Supplier Part Number 1: LTC6820IUD#PBF-ND; RoHS: RoHS Compliant; Category: Integrated Circuits (ICs); Stock 1: 827; Pricing 1: 1=7.35, 25=4.8816, 100=4.0066 (CAD); Packaging: Tube; Part Status: Active; Applications: Isolated Communications Interface; Package / Case: 16-WFQFN Exposed Pad; Supplier Device Package: 16-QFN (3x3); Mounting Type: Surface Mount; ComponentLink1URL: http://www.linear.com/docs/42317; ComponentLink1Description: http://www.linear.com/docs/42317
XFMR1 = IC PULSE XFMR 1CT:1CT 350UH SMD: PULSE XFMR 1CT:1CT 350UH SMD; Manufacturer: Bourns Inc.; Isolation Voltage: 1.5kVrms; Supplier: Digikey; Supplier_PN: PT61018AAPEL-SCT-ND; Inductance: 350uH; Supplier 1: Digi-Key; Supplier Part Number 1: PT61018AAPEL-SCT-ND

## Sheet BMS Carrier - Current Sense Interface.SchDoc: Current Sense isoSPI Interface
size Letter; Revision: 2.1; Website: www.uwmidsun.com
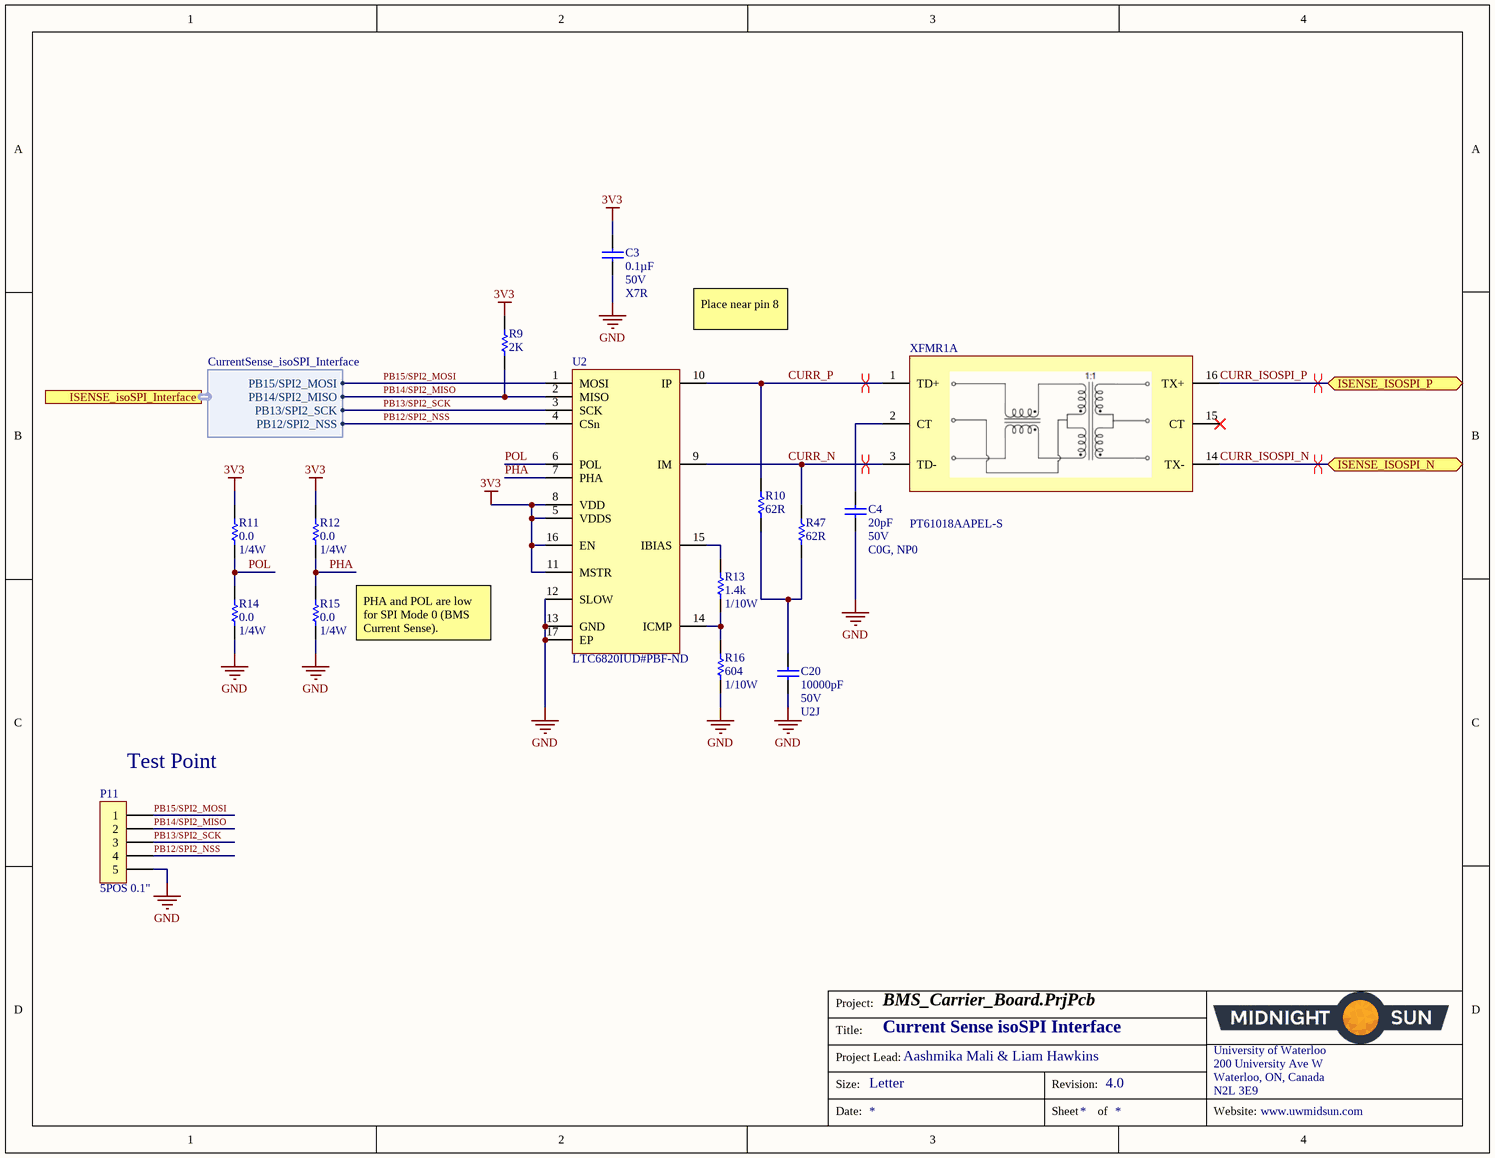
[diagram p3: BMS Carrier - Current Sense Interface.SchDoc]

### Parts
C3  Capacitance: 0.1µF  Voltage: 50V  Temperature Coefficient: X7R  [CAP, 0603]  (hidden comment: CAP CER 0.1UF 50V 10% X7R 0603)
C4  Capacitance: 20pF  Voltage: 50V  Temperature Coefficient: C0G, NP0  [CAP, 0603]  (hidden comment: CAP CER 20PF 50V ±5% C0G/NP0 0603)
C20  Capacitance: 10000pF  Voltage: 50V  Temperature Coefficient: U2J  [CAP, 0603]  (hidden comment: CAP CER 10nF 50V 5% X7R 0603)
P11  5POS 0.1"  [CONN, 5POS HEADR 0.1"]
R9  2K  [RES, 0603]
R10  62R  [RES, 0603]
R11  Resistance: 0.0  Power (Watts): 1/4W  [RES, 0603]  (hidden comment: RES 0.0 OHM 1/4W 0603)
R12  Resistance: 0.0  Power (Watts): 1/4W  [RES, 0603]  (hidden comment: RES 0.0 OHM 1/4W 0603)
R13  Resistance: 1.4k  Power: 1/10W  [RES, 0603]  (hidden comment: RES 1.4k OHM 1% 1/10W 0603)
R14  Resistance: 0.0  Power (Watts): 1/4W  [RES, 0603]  (hidden comment: RES 0.0 OHM 1/4W 0603)
R15  Resistance: 0.0  Power (Watts): 1/4W  [RES, 0603]  (hidden comment: RES 0.0 OHM 1/4W 0603)
R16  Resistance: 604  Power: 1/10W  [RES, 0603]  (hidden comment: RES 604 OHM 1% 1/10W 0603)
R47  62R  [RES, 0603]
U2  Supplier Part Number 1: LTC6820IUD#PBF-ND  [IC COMM INTERFACE ISOSPI 16-QFN]  (hidden comment: IC ISOSPI COMM INTERFACE LTC6820IUD)
XFMR1  MFG_PN: PT61018AAPEL-S  [IC, PULSE XFMR 1CT:1CT 350UH SMD]  (hidden comment: IC PULSE XFMR 1CT:1CT 350UH SMD)  (part A of 2)

### Ports
ISENSE_isoSPI_Interface (harness CurrentSense_isoSPI_Interface), ISENSE_ISOSPI_N (bidir), ISENSE_ISOSPI_P (bidir)

### Harnesses
CurrentSense_isoSPI_Interface: PB15/SPI2_MOSI, PB14/SPI2_MISO, PB13/SPI2_SCK, PB12/SPI2_NSS

### Nets
3V3: C3.1 R9.1 R11.1 R12.1 U2.5(VDDS) U2.8(VDD) U2.11(MSTR) U2.16(EN)
GND: C3.2 C4.2 C20.2 P11.5 R14.2 R15.2 R16.2 U2.12(SLOW) U2.13(GND) U2.17(EP)
CURR_ISOSPI_N: XFMR1.14(TX-) ; port ISENSE_ISOSPI_N
CURR_ISOSPI_P: XFMR1.16(TX+) ; port ISENSE_ISOSPI_P
CURR_N: R47.1 U2.9(IM) XFMR1.3(TD-)
CURR_P: R10.1 U2.10(IP) XFMR1.1(TD+)
PB12/SPI2_NSS: P11.4 U2.4(CSn) ; port ISENSE_isoSPI_Interface.PB12/SPI2_NSS
PB13/SPI2_SCK: P11.3 U2.3(SCK) ; port ISENSE_isoSPI_Interface.PB13/SPI2_SCK
PB14/SPI2_MISO: P11.2 R9.2 U2.2(MISO) ; port ISENSE_isoSPI_Interface.PB14/SPI2_MISO
PB15/SPI2_MOSI: P11.1 U2.1(MOSI) ; port ISENSE_isoSPI_Interface.PB15/SPI2_MOSI
PHA: R12.2 R15.1 U2.7(PHA)
POL: R11.2 R14.1 U2.6(POL)
NetC4_1: C4.1 XFMR1.2(CT)
NetC20_1: C20.1 R10.2 R47.2
NetR13_1: R13.1 U2.15(IBIAS)
NetR13_2: R13.2 R16.1 U2.14(ICMP)

Not connected (* = marked no-connect by the designer): XFMR1 15(CT)*

### Layout directives
differential pair: CURR_ISOSPI_N, CURR_ISOSPI_P, CURR_N, CURR_P

### Notes on the sheet
- Place near pin 8
- PHA and POL are low for SPI Mode 0 (BMS Current Sense).
- (near P11) Test Point
- Project:
- Title:
- Size:
- Project Lead:
- Letter
- Revision:
- University of Waterloo
- 200 University Ave W
- Waterloo, ON, Canada
- N2L 3E9
- Date:
- Sheet
- of
- Website:

### Library data of the parts
C3 = CAP CER 0.1UF 50V 10% X7R 0603: as C1 on sheet BMS Carrier - AFE Interface; Supplier 1: Digi-Key; Supplier Part Number 1: 478-5052-1-ND; Packaging: Cut Tape (CT); Part Status: Active; Operating Temperature: -55°C ~ 125°C; Ratings: -; Mounting Type: Surface Mount, MLCC; Package / Case: 0603 (1608 Metric); Size / Dimension: 0.063" L x 0.032" W (1.60mm x 0.81mm); Height - Seated (Max): -; Thickness (Max): 0.035" (0.90mm); Lead Spacing: -; Lead Style: -; ComponentLink1URL: http://datasheets.avx.com/X7RDielectric.pdf; ComponentLink1Description: http://datasheets.avx.com/X7RDielectric.pdf; Tolerance: ±10%
C4 = CAP CER 20PF 50V ±5% C0G/NP0 0603: as C2 on sheet BMS Carrier - AFE Interface; Supplier 1: Digi-Key; Supplier Part Number 1: 490-1410-1-ND; Packaging: Cut Tape (CT); Part Status: Active; Operating Temperature: -55°C ~ 125°C; Ratings: -; Mounting Type: Surface Mount, MLCC; Package / Case: 0603 (1608 Metric); Size / Dimension: 0.063" L x 0.031" W (1.60mm x 0.80mm); Height - Seated (Max): -; Thickness (Max): 0.035" (0.90mm); Lead Spacing: -; Lead Style: -; ComponentLink1URL: http://www.murata.com/~/media/webrenewal/support/library/catalog/products/capacitor/mlcc/c02e.ashx; ComponentLink1Description: http://www.murata.com/~/media/webrenewal/support/library/catalog/products/capacitor/mlcc/c02e.ashx; Tolerance: ±5%
C20 = CAP CER 10nF 50V 5% X7R 0603: as C19 on sheet BMS Carrier - AFE Interface; Supplier 1: Digi-Key; Supplier Part Number 1: 399-13384-1-ND; Packaging: Cut Tape (CT); Part Status: Active; Operating Temperature: -55°C ~ 125°C; Ratings: -; Failure Rate: -; Mounting Type: Surface Mount, MLCC; Package / Case: 0603 (1608 Metric); Size / Dimension: 0.063" L x 0.032" W (1.60mm x 0.80mm); Height - Seated (Max): -; Thickness (Max): 0.034" (0.87mm); Lead Spacing: -; Lead Style: -; ComponentLink1URL: http://www.kemet.com/docfinder?Partnumber=C0603C103J5JAC7867; ComponentLink1Description: http://www.kemet.com/docfinder?Partnumber=C0603C103J5JAC7867; Tolerance: ±5%
P11 = CONN 5POS HEADR MALE 0.1": as P10 on sheet BMS Carrier - AFE Interface; Supplier 1: Digi-Key; Supplier Part Number 1: WM50014-05-ND; Stock 1: 3161; Pricing 1: 1=0.22, 10=0.21, 25=0.1796, 50=0.157, 100=0.1459, 250=0.129, 500=0.1234 (USD); Mount: Through Hole; Colour: Black; Contact Plating: Nickel,Tin; Contact Material: Bronze,Brass; Housing Colour: Black; Housing Material: Nylon; Min Operating Temperature: 0°C; Max Operating Temperature: 75°C; Packaging: Bulk; Number of Rows: 1; Termination: Solder; Number of Contacts: 5; Orientation: Straight; Max Voltage Rating (DC): 250V; Length: 12.7mm; Depth: 2.49mm; Contact Mating Length: 0.24inch; ComponentLink1URL: https://datasheet.ciiva.com/6814/022284363-sd-6814049.pdf; ComponentLink1Description: https://datasheet.ciiva.com/6814/022284363-sd-6814049.pdf; ComponentLink2URL: https://datasheet.ciiva.com/14804/179390022284050-pcb-headers-14804361.pdf; ComponentLink2Description: https://datasheet.ciiva.com/14804/179390022284050-pcb-headers-14804361.pdf; ComponentLink3URL: https://datasheet.ciiva.com/15217/getdatasheetpartid-256138-15217709.pdf; ComponentLink3Description: https://datasheet.ciiva.com/15217/getdatasheetpartid-256138-15217709.pdf
R9 = RES 2K OHM 1% 1/10W 0603: as R5 on sheet BMS Carrier - AFE Interface; Supplier 1: Digi-Key; RoHS: RoHS Compliant; Category: Resistors; Stock 1: 1750701; Pricing 1: 1=0.15, 10=0.023, 100=0.0093, 1000=0.00415, 2500=0.0036 (CAD); Packaging: Cut Tape (CT); Part Status: Active; Resistance (Ohms): 2k; Tolerance: ±1%; Power (Watts): 0.1W, 1/10W; Composition: Thick Film; Features: Moisture Resistant; Operating Temperature: -55°C ~ 155°C; Package / Case: 0603 (1608 Metric); Supplier Device Package: 0603; Size / Dimension: 0.063" L x 0.031" W (1.60mm x 0.80mm); Height - Seated (Max): 0.022" (0.55mm); Failure Rate: -; ComponentLink1URL: http://www.yageo.com/documents/recent/PYu-RC_Group_51_RoHS_L_7.pdf; ComponentLink1Description: http://www.yageo.com/documents/recent/PYu-RC_Group_51_RoHS_L_7.pdf; Supplier Part Number 1: 311-2.00KHRCT-ND
R10 R47 = RES 62 OHM 0.1% 1/10W 0603: as R6 on sheet BMS Carrier - AFE Interface; Supplier 1: Digi-Key; RoHS: RoHS Compliant; Category: Resistors; Stock 1: 10320; Pricing 1: 1=0.52, 10=0.447, 100=0.1748, 1000=0.07317, 2500=0.06708 (CAD); Packaging: Cut Tape (CT); Part Status: Active; Tolerance: ±0.1%; Power (Watts): 0.1W, 1/10W; Composition: Thin Film; Features: Automotive AEC-Q200; Operating Temperature: -55°C ~ 155°C; Package / Case: 0603 (1608 Metric); Supplier Device Package: 0603; Size / Dimension: 0.063" L x 0.032" W (1.60mm x 0.80mm); Height - Seated (Max): 0.022" (0.55mm); Failure Rate: -; ComponentLink1URL: https://industrial.panasonic.com/cdbs/www-data/pdf/RDM0000/AOA0000C307.pdf; ComponentLink1Description: https://industrial.panasonic.com/cdbs/www-data/pdf/RDM0000/AOA0000C307.pdf; Supplier Part Number 1: P62DBCT-ND
R11 R12 R14 R15 = RES 0.0 OHM 1/4W 0603: as R1 on sheet Controller_Board_Interface; Supplier 1: Digi-Key; Supplier Part Number 1: 541-0.0SBCT-ND; Packaging: Cut Tape (CT); Part Status: Active; Composition: Thick Film; Operating Temperature: -55°C ~ 155°C; Package / Case: 0603 (1608 Metric); Supplier Device Package: 0603; Size / Dimension: 0.063" L x 0.033" W (1.60mm x 0.85mm); Height - Seated (Max): 0.022" (0.55mm); Failure Rate: -; ComponentLink1URL: http://www.vishay.com/docs/20043/crcwhpe3.pdf; ComponentLink1Description: http://www.vishay.com/docs/20043/crcwhpe3.pdf
R13 = RES 1.4k OHM 1% 1/10W 0603: as R7 on sheet BMS Carrier - AFE Interface; Supplier 1: Digi-Key; Supplier Part Number 1: 311-1.40KHRCT-ND; Packaging: Cut Tape (CT); Part Status: Active; Composition: Thick Film; Operating Temperature: -55°C ~ 155°C; Package / Case: 0603 (1608 Metric); Supplier Device Package: 0603; Size / Dimension: 0.063" L x 0.031" W (1.60mm x 0.80mm); Height - Seated (Max): 0.022" (0.55mm); Failure Rate: -; ComponentLink1URL: http://www.yageo.com/documents/recent/PYu-RC_Group_51_RoHS_L_7.pdf; ComponentLink1Description: http://www.yageo.com/documents/recent/PYu-RC_Group_51_RoHS_L_7.pdf; Tolerance: ±1%
R16 = RES 604 OHM 1% 1/10W 0603: as R2 on sheet Controller_Board_Interface; Supplier 1: Digi-Key; Supplier Part Number 1: 311-604HRCT-ND; Packaging: Cut Tape (CT); Part Status: Active; Composition: Thick Film; Operating Temperature: -55°C ~ 155°C; Package / Case: 0603 (1608 Metric); Supplier Device Package: 0603; Size / Dimension: 0.063" L x 0.031" W (1.60mm x 0.80mm); Height - Seated (Max): 0.022" (0.55mm); Failure Rate: -; ComponentLink1URL: http://www.yageo.com/documents/recent/PYu-RC_Group_51_RoHS_L_7.pdf; ComponentLink1Description: http://www.yageo.com/documents/recent/PYu-RC_Group_51_RoHS_L_7.pdf; Tolerance: ±1%
U2 = IC ISOSPI COMM INTERFACE LTC6820IUD: as U1 on sheet BMS Carrier - AFE Interface; Supplier 1: Digi-Key; RoHS: RoHS Compliant; Category: Integrated Circuits (ICs); Stock 1: 827; Pricing 1: 1=7.35, 25=4.8816, 100=4.0066 (CAD); Packaging: Tube; Part Status: Active; Applications: Isolated Communications Interface; Package / Case: 16-WFQFN Exposed Pad; Supplier Device Package: 16-QFN (3x3); Mounting Type: Surface Mount; ComponentLink1URL: http://www.linear.com/docs/42317; ComponentLink1Description: http://www.linear.com/docs/42317
XFMR1 = IC PULSE XFMR 1CT:1CT 350UH SMD: as XFMR1 on sheet BMS Carrier - AFE Interface; Supplier: Digikey; Supplier_PN: PT61018AAPEL-SCT-ND; Inductance: 350uH; Supplier 1: Digi-Key; Supplier Part Number 1: PT61018AAPEL-SCT-ND